# EAGLE schematic motorcontrol_v2 (EAGLE 6.5.0)
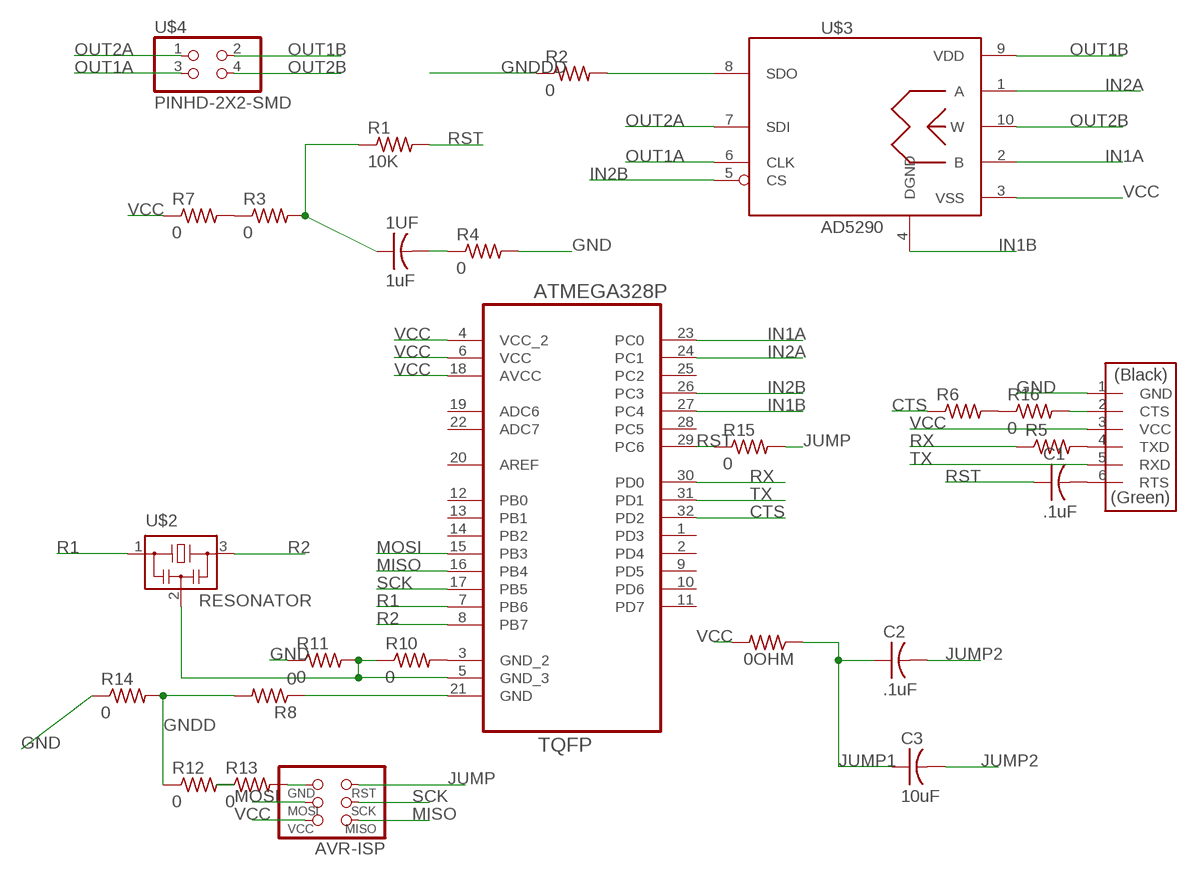
[diagram p0: schematic, sheet 1]

## Parts
0OHM  RES-US1206FAB  [R1206FAB]
1UF  1uF  CAP-US1206FAB  [C1206FAB]
AVR-ISP  AVRISPSMD  [2X03SMD]
C1  .1uF  CAP-US1206FAB  [C1206FAB]
C2  .1uF  CAP-US1206FAB  [C1206FAB]
C3  10uF  CAP-US1206FAB  [C1206FAB]
R1  10K  RES-US1206FAB  [R1206FAB]
R2  0  RES-US1206FAB  [R1206FAB]
R3  0  RES-US1206FAB  [R1206FAB]
R4  0  RES-US1206FAB  [R1206FAB]
R5  RES-US1206FAB  [R1206FAB]
R6  RES-US1206FAB  [R1206FAB]
R7  0  RES-US1206FAB  [R1206FAB]
R8  0  RES-US1206FAB  [R1206FAB]
R10  0  RES-US1206FAB  [R1206FAB]
R11  0  RES-US1206FAB  [R1206FAB]
R12  0  RES-US1206  [R1206]
R13  0  RES-US1206  [R1206]
R14  0  RES-US1206FAB  [R1206FAB]
R15  0  RES-US1206FAB  [R1206FAB]
R16  0  RES-US1206FAB  [R1206FAB]
U1  ATMEGA328P-AU  [QFP80P900X900X120-32N]
U$1  FTDI-SMD-HEADER  [1X06SMD]
U$2  RESONATOR  [EFOBM]
U$3  AD5290  [MSOP_10]
U$4  PINHD-2X2-SMD  [2X02SMD]

## Nets
CTS: R6.1 U1.32(PD2)
GNA: R10.1 R11.2 U1.5(GND_3) U$2.2
GND: R4.2 R11.1 R14.1 U$1.1(GND)
GNDD: R8.2 R12.1 R14.2
GNDDD: R2.1 R8.1 U1.21(GND)
IN1A: U1.23(PC0) U$3.2(B)
IN1B: U1.27(PC4) U$3.4(DGND)
IN2A: U1.24(PC1) U$3.1(A)
IN2B: U1.26(PC3) U$3.5(CS)
JUMP: AVR-ISP.5(RST) R15.2
JUMP1: 0OHM.1 C2.1 C3.1
JUMP2: C2.2 C3.2 R2.2 U$3.8(SDO)
MISO: AVR-ISP.1(MISO) U1.16(PB4)
MOSI: AVR-ISP.4(MOSI) U1.15(PB3)
N$1: R5.2 U$1.4(TXD)
N$2: R6.2 R16.1
N$3: 1UF.1 R1.1 R3.2
N$4: R3.1 R7.2
N$6: R10.2 U1.3(GND_2)
N$7: R16.2 U$1.2(CTS)
N$8: AVR-ISP.6(GND) R13.2
N$10: C1.2 U$1.6(RTS)
N$12: 1UF.2 R4.1
N$13: R12.2 R13.1
OUT1A: U$3.6(CLK) U$4.3
OUT1B: U$3.9(VDD) U$4.2
OUT2A: U$3.7(SDI) U$4.1
OUT2B: U$3.10(W) U$4.4
R1: U1.7(PB6) U$2.1
R2: U1.8(PB7) U$2.3
RST: C1.1 R1.2 R15.1 U1.29(PC6)
RX: R5.1 U1.30(PD0)
SCK: AVR-ISP.3(SCK) U1.17(PB5)
TX: U1.31(PD1) U$1.5(RXD)
VCC: 0OHM.2 AVR-ISP.2(VCC) R7.1 U1.4(VCC_2) U1.6(VCC) U1.18(AVCC) U$1.3(VCC) U$3.3(VSS)
Unconnected: U1.1(PD3) U1.2(PD4) U1.9(PD5) U1.10(PD6) U1.11(PD7) U1.12(PB0) U1.13(PB1) U1.14(PB2) U1.19(ADC6) U1.20(AREF) U1.22(ADC7) U1.25(PC2) U1.28(PC5)

## Library data of the parts
0OHM R1-R8 R10-R16 = fab:RES-US: Resistor (US Symbol) Variants with postfix FAB are widened to allow the routing of internal traces
1UF C1-C3 = fab:CAP-US
AVR-ISP = fab:AVRISP
U1 = fab:ATMEGA328P-AU; DESCRIPTION: 8-bit Microcontroller with In-System Programmable Flash; MPN: ATMEGA328P-AU; OC_FARNELL: 1715486; OC_NEWARK: 14R4631; PACKAGE: TQFP-32; SUPPLIER: Atmel
U$1 = fab:FTDI-SMD-HEADER
U$2 = fab:RESONATOR
U$3 = BillPorter:AD5290: AD5290 SPI Compact +30 V / ±15 V 256-Position Digital Potentiometer in a 10-TFSOP, 10-MSOP package. Specs @ http://www.analog.com/en/digital-to-analog-converters/digital-potentiometers/ad5290/products/product.html
U$4 = fab:PINHD-2X2-SMD